# Altium schematic sheet ST-LINK.SchDoc
size A4; SheetNumber: 2; SheetTotal: 2
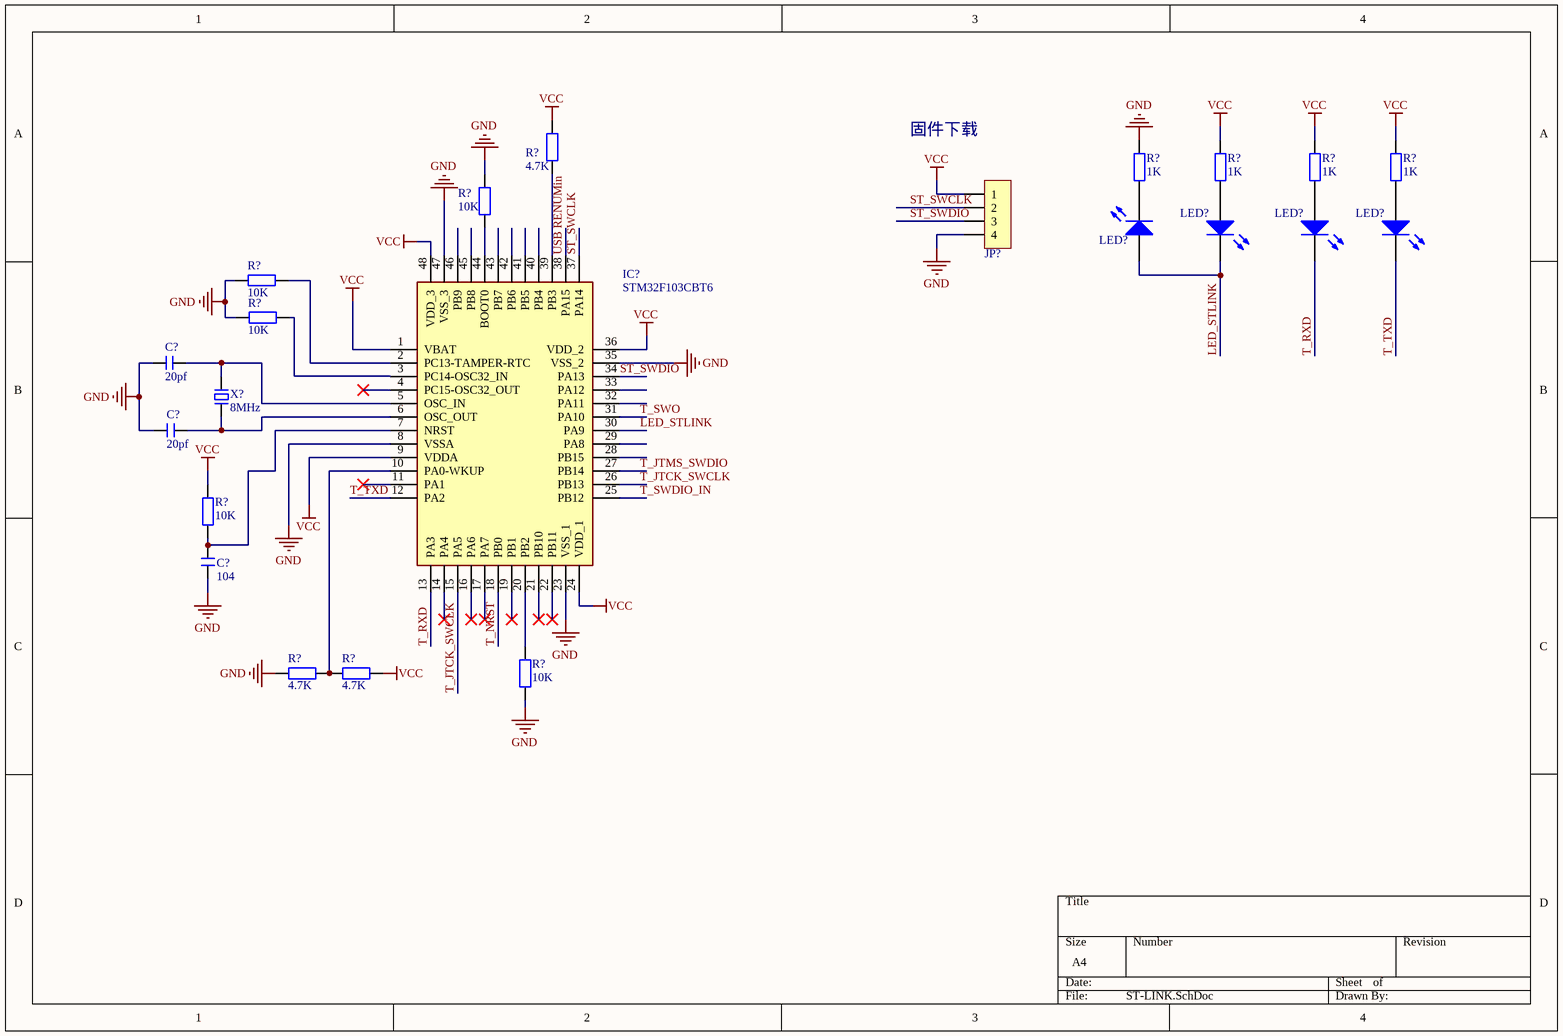
[diagram p0: ST-LINK.SchDoc]

## Parts
(Parts that share a designator on the sheet are numbered #1, #2 ... from top to bottom, then left to right.)
C?#1  20pf  [C0201_L]
C?#2  20pf  [C0201_L]
C?#3  104  [C0201_L]
IC?  STM32F103CBT6  [QFP50P900X900X160-48N]
JP?  HDR-1X4  [HDR2.54-LI-4P]  (value not drawn)
LED?#1  (no value)  [LED0603_G]
LED?#2  (no value)  [LED0603_G]
LED?#3  (no value)  [LED0603_G]
LED?#4  (no value)  [LED0603_G]
R?#1  4.7K  [R0805_L]
R?#2  1K  [R0805_L]
R?#3  1K  [R0805_L]
R?#4  1K  [R0805_L]
R?#5  1K  [R0805_L]
R?#6  10K  [R0805_L]
R?#7  10K  [R0805_L]
R?#8  10K  [R0805_L]
R?#9  10K  [R0805_L]
R?#10  10K  [R0805_L]
R?#11  4.7K  [R0805_L]
R?#12  4.7K  [R0805_L]
X?  8MHz  [OSC 5032-2P]

## Nets
GND: C?#1.1 C?#2.1 C?#3.1 IC?.8(VSSA) IC?.23(VSS_1) IC?.35(VSS_2) IC?.47(VSS_3) JP?.4 R?#2.2 R?#6.2 R?#7.2 R?#8.2 R?#10.2 R?#11.1
VCC: IC?.1(VBAT) IC?.9(VDDA) IC?.24(VDD_1) IC?.36(VDD_2) IC?.48(VDD_3) JP?.1 R?#1.2 R?#3.2 R?#4.2 R?#5.2 R?#9.1 R?#12.2
LED_STLINK: IC?.30(PA9) LED?#1.1(A) LED?#2.2(K)
ST_SWCLK: IC?.37(PA14) JP?.2
ST_SWDIO: IC?.34(PA13) JP?.3
T_JTCK_SWCLK: IC?.15(PA5) IC?.26(PB13)
T_JTMS_SWDIO: IC?.27(PB14)
T_NRST: IC?.18(PB0)
T_RXD: IC?.13(PA3) LED?#3.2(K)
T_SWDIO_IN: IC?.25(PB12)
T_SWO: IC?.31(PA10)
T_TXD: IC?.12(PA2) LED?#4.2(K)
USB RENUMin: IC?.38(PA15)
NetC?#1_2: C?#1.2 IC?.5(OSC_IN) X?.2
NetC?#2_2: C?#2.2 IC?.6(OSC_OUT) X?.1
NetC?#3_2: C?#3.2 IC?.7(NRST) R?#9.2
NetIC?_2: IC?.2(PC13-TAMPER-RTC) R?#7.1
NetIC?_3: IC?.3(PC14-OSC32_IN) R?#8.1
NetIC?_10: IC?.10(PA0-WKUP) R?#11.2 R?#12.1
NetIC?_20: IC?.20(PB2) R?#10.1
NetIC?_39: IC?.39(PB3) R?#1.1
NetIC?_44: IC?.44(BOOT0) R?#6.1
NetLED?#1_2: LED?#1.2(K) R?#2.1
NetLED?#2_1: LED?#2.1(A) R?#3.1
NetLED?#3_1: LED?#3.1(A) R?#4.1
NetLED?#4_1: LED?#4.1(A) R?#5.1

Not connected (* = marked no-connect by the designer): IC? 4(PC15-OSC32_OUT)* 11(PA1)* 14(PA4)* 16(PA6)* 17(PA7)* 19(PB1)* 21(PB10)* 22(PB11)* 28(PB15) 29(PA8) 32(PA11) 33(PA12) 40(PB4) 41(PB5) 42(PB6) 43(PB7) 45(PB8) 46(PB9)

## Notes on the sheet
- 固件下载

## Library data of the parts
C?#1-C?#3 = C: 贴片电容; BOM名称: 无极性贴片电容; 淘宝ID: 封装库来自淘宝 ID：黄晶宝石; 联系售后，技术支持: https://shop463601444.taobao.com; 唯一出售店铺网址: https://shop463601444.taobao.com
IC? = STM32F103CBT6: Integrated Circuit; Manufacturer_Name: STMicroelectronics; Datasheet Link: http://www.st.com/st-web-ui/static/active/en/resource/technical/document/datasheet/CD00161566.pdf; Height: 1.6mm; Manufacturer_Part_Number: STM32F103CBT6; Mouser Part Number: 511-STM32F103CBT6; Mouser Price/Stock: https://www.mouser.co.uk/ProductDetail/STMicroelectronics/STM32F103CBT6?qs=WxFF5lh7QM3goh6GV5Ogig%3D%3D; Arrow Part Number: STM32F103CBT6; Arrow Price/Stock: https://www.arrow.com/en/products/stm32f103cbt6/stmicroelectronics?utm_currency=USD&region=nac
JP? = Header 4: 4P接插件; 版权归属: 封装库来自淘宝 ID：黄晶宝石; 学习资源: 最新版本发布https://item.taobao.com/item.htm?id=566775463719; BOM名称: 4P接插件
LED?#1-LED?#4 = LED-SMD: 贴片LED; 版权归属: 封装库来自淘宝 ID：黄晶宝石; BOM名称: 贴片LED
R?#1-R?#12 = R: 贴片电阻; 版权归属: 来自淘宝 ID：黄晶宝石; 封装库来自淘宝卖家 ID：黄晶宝石: 其他店铺购入均为盗版，不享受售后技术支持服务，请立即申请退款; BOM名称: 贴片电阻; 联系售后: https://item.taobao.com/item.htm?id=566775463719
X? = XTAL-2P: 2脚无源脚晶振; 版权归属: 封装库来自淘宝卖家 ID：黄晶宝石; BOM名称: 2脚无源脚晶振; 学习资源: https://shop463601444.taobao.com